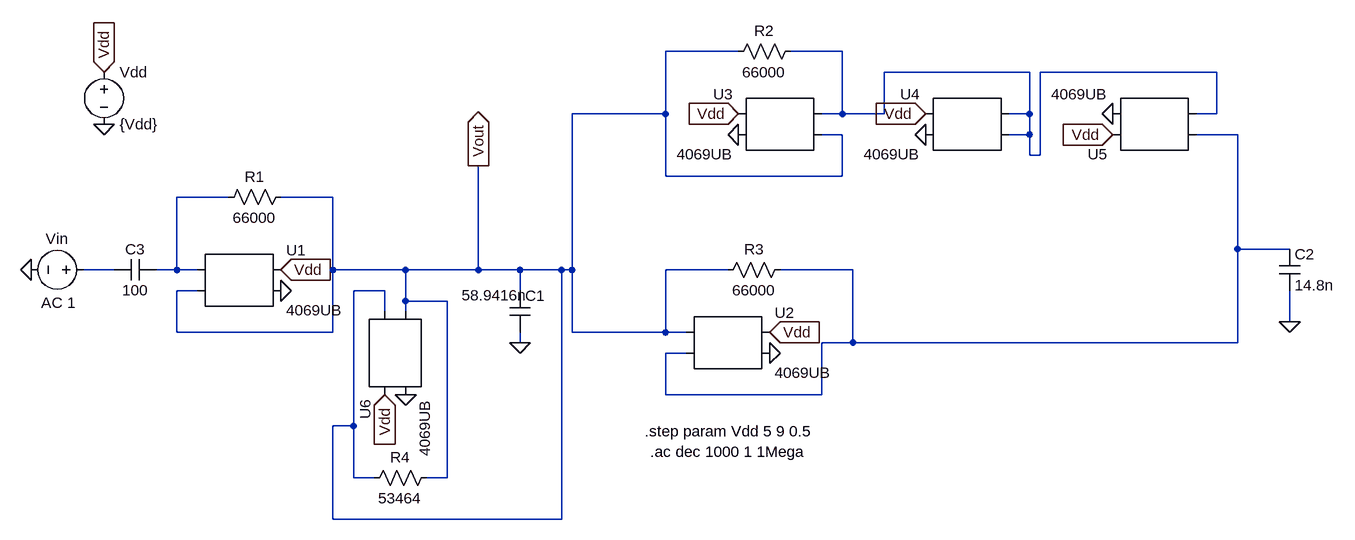
[diagram p0: schematic testbench_gm_C_filter.asc]
testbench_gm_C_filter.asc, the LTspice schematic file:
Version 4
SHEET 1 1276 680
WIRE 352 -192 240 -192
WIRE 512 -192 432 -192
WIRE 800 -160 576 -160
WIRE 1088 -160 816 -160
WIRE 240 -96 240 -192
WIRE 240 -96 96 -96
WIRE 512 -96 512 -192
WIRE 512 -96 480 -96
WIRE 576 -96 576 -160
WIRE 576 -96 512 -96
WIRE 800 -96 800 -160
WIRE 800 -96 768 -96
WIRE 1088 -96 1088 -160
WIRE 1088 -96 1056 -96
WIRE 512 -64 480 -64
WIRE 800 -64 800 -96
WIRE 800 -64 768 -64
WIRE 1120 -64 1056 -64
WIRE 800 -32 800 -64
WIRE 816 -32 816 -160
WIRE 816 -32 800 -32
WIRE 240 0 240 -96
WIRE 512 0 512 -64
WIRE 512 0 240 0
WIRE -432 32 -512 32
WIRE -272 32 -352 32
WIRE 1120 112 1120 -64
WIRE 1200 112 1120 112
WIRE -608 144 -656 144
WIRE -512 144 -512 32
WIRE -512 144 -544 144
WIRE -480 144 -512 144
WIRE -272 144 -272 32
WIRE -160 144 -272 144
WIRE -48 144 -48 -16
WIRE -48 144 -160 144
WIRE 16 144 -48 144
WIRE 80 144 16 144
WIRE 96 144 96 -96
WIRE 96 144 80 144
WIRE 336 144 240 144
WIRE 528 144 416 144
WIRE -480 176 -512 176
WIRE -192 176 -240 176
WIRE 16 176 16 144
WIRE -160 192 -160 144
WIRE -96 192 -160 192
WIRE -192 208 -192 176
WIRE -160 208 -160 192
WIRE 1200 224 1200 176
WIRE -512 240 -512 176
WIRE -272 240 -272 144
WIRE -272 240 -512 240
WIRE 96 240 96 144
WIRE 240 240 240 144
WIRE 240 240 96 240
WIRE 272 240 240 240
WIRE 16 256 16 240
WIRE 528 256 528 144
WIRE 528 256 480 256
WIRE 1120 256 1120 112
WIRE 1120 256 528 256
WIRE 272 272 240 272
WIRE 240 336 240 272
WIRE 480 336 480 256
WIRE 480 336 240 336
WIRE -240 384 -240 176
WIRE -240 384 -272 384
WIRE -240 464 -240 384
WIRE -208 464 -240 464
WIRE -96 464 -96 192
WIRE -96 464 -128 464
WIRE -272 528 -272 384
WIRE 80 528 80 144
WIRE 80 528 -272 528
FLAG -736 144 0
FLAG 16 256 0
FLAG -624 -80 0
FLAG -624 -160 Vdd
IOPIN -624 -160 In
FLAG -352 144 Vdd
IOPIN -352 144 In
FLAG 352 -96 Vdd
IOPIN 352 -96 In
FLAG 640 -96 Vdd
IOPIN 640 -96 In
FLAG 928 -64 Vdd
IOPIN 928 -64 In
FLAG 400 240 Vdd
IOPIN 400 240 In
FLAG 400 272 0
FLAG -352 176 0
FLAG 352 -64 0
FLAG 640 -64 0
FLAG 928 -96 0
FLAG -48 -16 Vout
IOPIN -48 -16 Out
FLAG 1200 224 0
FLAG -192 336 Vdd
IOPIN -192 336 In
FLAG -160 336 0
SYMBOL AutoGenerated\\4069UB -416 160 R0
SYMATTR InstName U1
SYMBOL voltage -640 144 R90
WINDOW 0 -32 56 VBottom 2
WINDOW 3 88 56 VTop 2
WINDOW 123 35 54 VTop 2
WINDOW 39 0 0 Left 0
SYMATTR InstName Vin
SYMATTR Value ""
SYMATTR Value2 AC 1
SYMBOL cap 0 176 R0
WINDOW 3 -74 7 Left 2
SYMATTR Value 58.9416n
SYMATTR InstName C1
SYMBOL AutoGenerated\\4069UB 336 256 R0
SYMATTR InstName U2
SYMBOL AutoGenerated\\4069UB 416 -80 M0
SYMATTR InstName U3
SYMBOL AutoGenerated\\4069UB 704 -80 M0
SYMATTR InstName U4
SYMBOL AutoGenerated\\4069UB 992 -80 R180
SYMATTR InstName U5
SYMBOL voltage -624 -176 R0
WINDOW 123 0 0 Left 0
WINDOW 39 0 0 Left 0
SYMATTR InstName Vdd
SYMATTR Value {Vdd}
SYMBOL cap 1184 112 R0
SYMATTR InstName C2
SYMATTR Value 14.8n
SYMBOL AutoGenerated\\4069UB -176 272 M90
SYMATTR InstName U6
SYMBOL res -336 16 R90
WINDOW 0 0 56 VBottom 2
WINDOW 3 32 56 VTop 2
SYMATTR InstName R1
SYMATTR Value 66000
SYMBOL res 448 -208 R90
WINDOW 0 0 56 VBottom 2
WINDOW 3 32 56 VTop 2
SYMATTR InstName R2
SYMATTR Value 66000
SYMBOL res 432 128 R90
WINDOW 0 0 56 VBottom 2
WINDOW 3 32 56 VTop 2
SYMATTR InstName R3
SYMATTR Value 66000
SYMBOL res -112 448 R90
WINDOW 0 0 56 VBottom 2
WINDOW 3 32 56 VTop 2
SYMATTR InstName R4
SYMATTR Value 53464
SYMBOL cap -544 128 R90
WINDOW 0 0 32 VBottom 2
WINDOW 3 32 32 VTop 2
SYMATTR InstName C3
SYMATTR Value 100
TEXT 208 392 Left 2 !.step param Vdd 5 9 0.5
TEXT 216 424 Left 2 !.ac dec 1000 1 1Mega

The netlist it stands for:
* testbench_gm_C_filter.asc
* U1: 4069UB (symbol AutoGenerated\4069UB not available, pins judged from their places): pin1=N003 pin2=Vout pin3=Vdd pin4=0
Vin N004 0 AC 1
C1 Vout 0 58.9416n
* U2: 4069UB (symbol AutoGenerated\4069UB not available, pins judged from their places): pin1=Vout pin2=N002 pin3=Vdd pin4=0
* U3: 4069UB (symbol AutoGenerated\4069UB not available, pins judged from their places): pin1=N001 pin2=Vout pin3=Vdd pin4=0
* U4: 4069UB (symbol AutoGenerated\4069UB not available, pins judged from their places): pin1=N001 pin2=N001 pin3=Vdd pin4=0
* U5: 4069UB (symbol AutoGenerated\4069UB not available, pins judged from their places): pin1=N002 pin2=N001 pin3=Vdd pin4=0
Vdd Vdd 0 {Vdd}
C2 N002 0 14.8n
* U6: 4069UB (symbol AutoGenerated\4069UB not available, pins judged from their places): pin1=Vout pin2=Vout pin3=Vdd pin4=0
R1 Vout N003 66000
R2 N001 Vout 66000
R3 N002 Vout 66000
R4 Vout Vout 53464
C3 N003 N004 100
.step param Vdd 5 9 0.5
.ac dec 1000 1 1Mega
.backanno
.end